# Altium schematic sheet Power_Cerebro.SchDoc
size A4
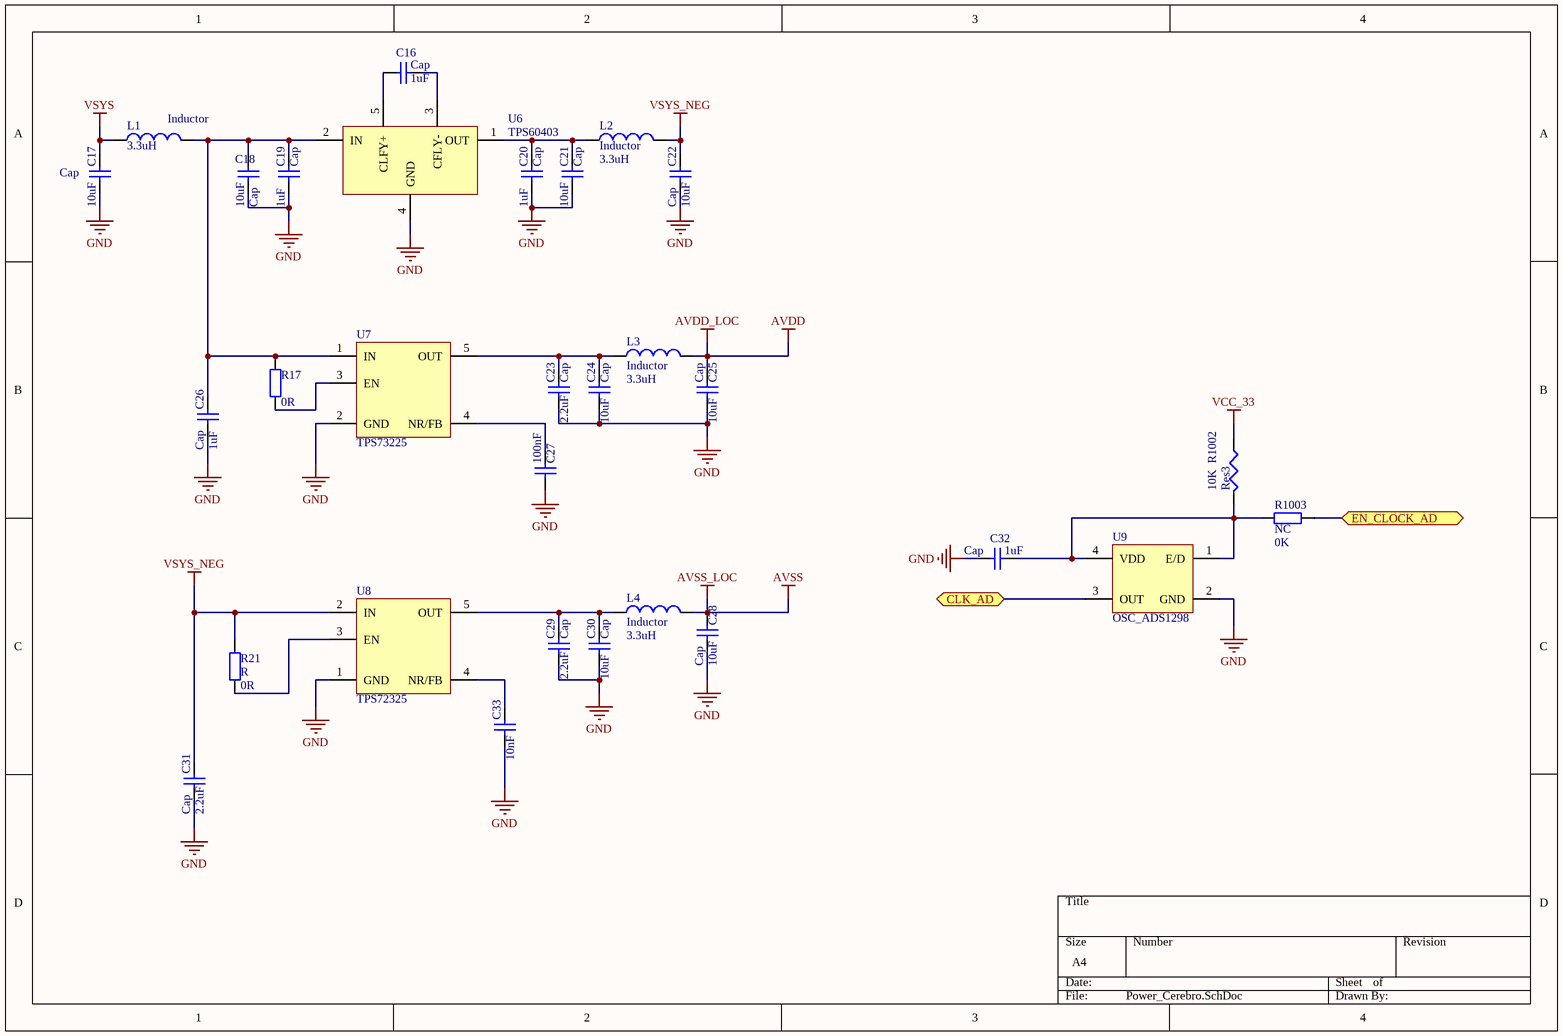
[diagram p0: Power_Cerebro.SchDoc]

## Parts
C16  Cap  value 1uF  [cap_0402_R - modified]
C17  Cap  value 10uF  [cap_0402_R - modified]
C18  Cap  value 10uF  [cap_0402_R - modified]
C19  Cap  value 1uF  [cap_0402_R - modified]
C20  Cap  value 1uF  [cap_0402_R - modified]
C21  Cap  value 10uF  [cap_0402_R - modified]
C22  Cap  value 10uF  [cap_0402_R - modified]
C23  Cap  value 2.2uF  [cap_0402_R - modified]
C24  Cap  value 10uF  [cap_0402_R - modified]
C25  Cap  value 10uF  [cap_0402_R - modified]
C26  Cap  value 1uF  [cap_0402_R - modified]
C27  value 100nF  [cap_0402_R - modified]  (hidden comment: C)
C28  Cap  value 10uF  [cap_0402_R - modified]
C29  Cap  value 2.2uF  [cap_0402_R - modified]
C30  Cap  value 10uF  [cap_0402_R - modified]
C31  Cap  value 2.2uF  [cap_0402_R - modified]
C32  Cap  value 1uF  [cap_0402_R - modified]
C33  value 10nF  [cap_0402_R - modified]  (hidden comment: C)
L1  Inductor  value 3.3uH  [0603]
L2  Inductor  value 3.3uH  [0603]
L3  Inductor  value 3.3uH  [0603]
L4  Inductor  value 3.3uH  [0603]
R17  value 0R  [cap_0402_R - modified]  (hidden comment: R)
R21  R  value 0R  [cap_0402_R - modified]
R1002  Res3  value 10K  [res_0402_R - modified]
R1003  NC  value 0K  [cap_0402_R - modified]
U6  TPS60403  [SOT_23__DBV_(R - PDSO - G5)]
U7  TPS73225  [SOT23__DDC__(R - PDSO-  G5)]
U8  TPS72325  [SOT23__DDC__(R - PDSO-  G5)]
U9  OSC_ADS1298  [HC735 - OSC ADS1298]

## Ports
CLK_AD (bidir), EN_CLOCK_AD (bidir)

## Nets
AVDD: C25.1 L3.2  [also labelled AVDD_LOC]
AVSS: C28.1 L4.2  [also labelled AVSS_LOC]
GND: C17.2 C18.2 C19.2 C20.2 C21.2 C22.2 C23.2 C24.2 C25.2 C26.2 C27.2 C28.2 C29.2 C30.2 C31.2 C32.2 C33.2 U6.4(GND) U7.2(GND) U8.1(GND) U9.2(GND)
VCC_33: R1002.1
VSYS: C17.1 L1.1
VSYS_NEG: C22.1 C31.1 L2.2 R21.1 U8.2(IN)
CLK_AD: U9.3(OUT) ; port CLK_AD
EN_CLOCK_AD: R1003.1 ; port EN_CLOCK_AD
NetC16_1: C16.1 U6.3(CFLY-)
NetC16_2: C16.2 U6.5(CLFY+)
NetC18_1: C18.1 C19.1 C26.1 L1.2 R17.2 U6.2(IN) U7.1(IN)
NetC20_1: C20.1 C21.1 L2.1 U6.1(OUT)
NetC23_1: C23.1 C24.1 L3.1 U7.5(OUT)
NetC27_1: C27.1 U7.4(NR/FB)
NetC29_1: C29.1 C30.1 L4.1 U8.5(OUT)
NetC32_1: C32.1 R1002.2 R1003.2 U9.1(E/D) U9.4(VDD)
NetC33_1: C33.1 U8.4(NR/FB)
NetR17_1: R17.1 U7.3(EN)
NetR21_2: R21.2 U8.3(EN)

## Library data of the parts
C16-C33 = Cap: Capacitor; Published: 8-Jun-2000; LatestRevisionDate: 17-Jul-2002; LatestRevisionNote: Re-released for DXP Platform.; PackageReference: RAD-0.3; Publisher: Altium Limited; PackageDescription: Radial Cap, Thru-Hole; 2 Leads; 0.3 in Pin Spacing
L1-L4 = Inductor: Code_IEC: 1005; Published: 8-Jun-2000; LatestRevisionDate: 29-May-2009; LatestRevisionNote: IPC-7351 Footprint Added.; PackageReference: 0402-A; Publisher: Altium Limited; PackageDescription: Chip Inductor; Code_JEITA: 0402
R17 R21 R1003 = Res2: Resistor; Published: 8-Jun-2000; LatestRevisionDate: 17-Jul-2002; LatestRevisionNote: Re-released for DXP Platform.; PackageReference: AXIAL-0.4; Publisher: Altium Limited; PackageDescription: Axial Device, Thru-Hole; 2 Leads; 0.4 in Pin Spacing
R1002 = Res3: Resistor; Published: 8-Jun-2000; LatestRevisionDate: 29-May-2009; LatestRevisionNote: IPC-7351 Footprint Added.; PackageReference: J1-0603; Publisher: Altium Limited; PackageDescription: Chip Resistor
U6 = TPS60403: Linear Regulator
U7 = TPS73225: Linear Regulator
U8 = TPS72325: Linear Regulator
U9 = OSC_ADS1298: Linear Regulator